# Altium schematic sheet irsensorLED.SchDoc
size A4
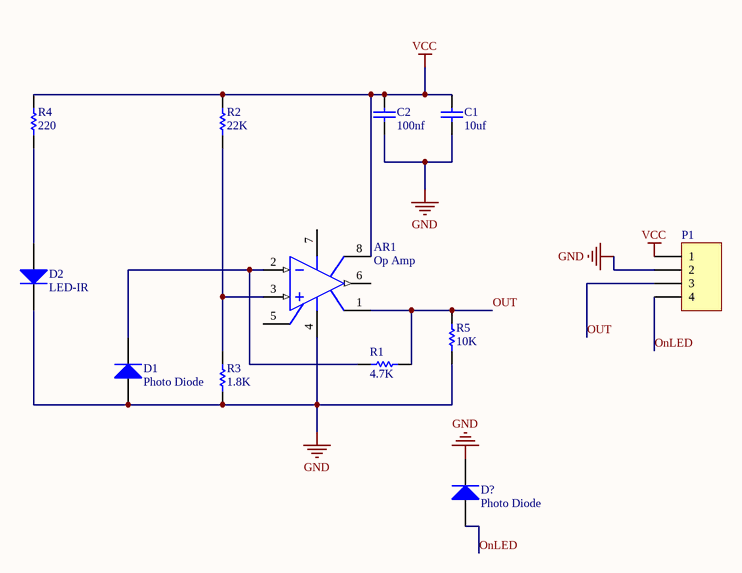
[diagram p0: irsensorLED.SchDoc]

## Parts
AR1  Op Amp  [H-08A]
C1  value 10uf  [RAD-0.3]  (hidden comment: Cap)
C2  value 100nf  [RAD-0.3]  (hidden comment: Cap)
D1  Photo Diode  [DO-35]
D2  LED-IR  [DO-35]
D?  Photo Diode  [DO-35]
P1  Header 4H  [HDR1X4H]  (value not drawn)
R1  value 4.7K  [AXIAL-0.3]  (hidden comment: Res1)
R2  value 22K  [AXIAL-0.3]  (hidden comment: Res1)
R3  value 1.8K  [AXIAL-0.3]  (hidden comment: Res1)
R4  value 220  [AXIAL-0.3]  (hidden comment: Res1)
R5  value 10K  [AXIAL-0.3]  (hidden comment: Res1)

## Nets
GND: AR1.4(V-) C1.2 C2.1 D1.1(A) D2.2(K) D?.2(K) P1.2 R3.2 R5.1
VCC: AR1.8(TAB) C1.1 C2.2 P1.1 R2.2 R4.2
OnLED: D?.1(A) P1.4
OUT: AR1.1(OS_NUL) P1.3 R1.1 R5.2
NetAR1_2: AR1.2(IN-) D1.2(K) R1.2
NetAR1_3: AR1.3(IN+) R2.1 R3.1
NetD2_1: D2.1(A) R4.1

Not connected (* = marked no-connect by the designer): AR1 5(OS_NUL) 6(OUT) 7(V+)

## Library data of the parts
AR1 = Op Amp: FET Operational Amplifier; Published: 8-Jun-2000; LatestRevisionDate: 17-Jul-2002; LatestRevisionNote: Re-released for DXP Platform.; DatasheetVersion: REV. B; PackageVersion: 1990; PackageReference: H-08A; Publisher: Altium Limited; PackageDescription: Can; 8 Leads; Pin Circle Dia. 5.08 mm; Lead Dia. 0.53 mm (max); ComponentLink1Description: Manufacturer Link; ComponentLink1URL: http://www.analog.com/
C1 C2 = Cap: Capacitor; Published: 8-Jun-2000; LatestRevisionDate: 17-Jul-2002; LatestRevisionNote: Re-released for DXP Platform.; PackageReference: RAD-0.3; Publisher: Altium Limited; PackageDescription: Radial Cap, Thru-Hole; 2 Leads; 0.3 in Pin Spacing
D1 D2 D? = Diode 1N914: High Conductance Fast Diode; Published: 8-Jun-2000; LatestRevisionDate: 17-Jul-2002; LatestRevisionNote: Re-released for DXP Platform.; DatasheetVersion: 1997; PackageReference: DO-35; Publisher: Altium Limited; PackageDescription: Diode, Axial; Body 3.8 x 1.9 mm (LxDia. max), Lead Dia. 0.53 mm (max); Code_JEDEC: DO-204-AH; ComponentLink1Description: Manufacturer Link; ComponentLink1URL: http://www.fairchildsemi.com/; ComponentLink2Description: Datasheet; ComponentLink2URL: http://www.fairchildsemi.com/ds/1N%2F1N4448.pdf
P1 = Header 4H: Header, 4-Pin, Right Angle; LatestRevisionDate: 17-Jul-2002; LatestRevisionNote: Re-released for DXP Platform.; Publisher: Altium Limited
R1-R5 = Res1: Resistor; Published: 8-Jun-2000; LatestRevisionDate: 17-Jul-2002; LatestRevisionNote: Re-released for DXP Platform.; PackageReference: AXIAL-0.3; Publisher: Altium Limited; PackageDescription: Axial Device, Thru-Hole; 2 Leads; 0.3 in Pin Spacing